# EAGLE schematic XibecaModule (EAGLE 9.6.2)
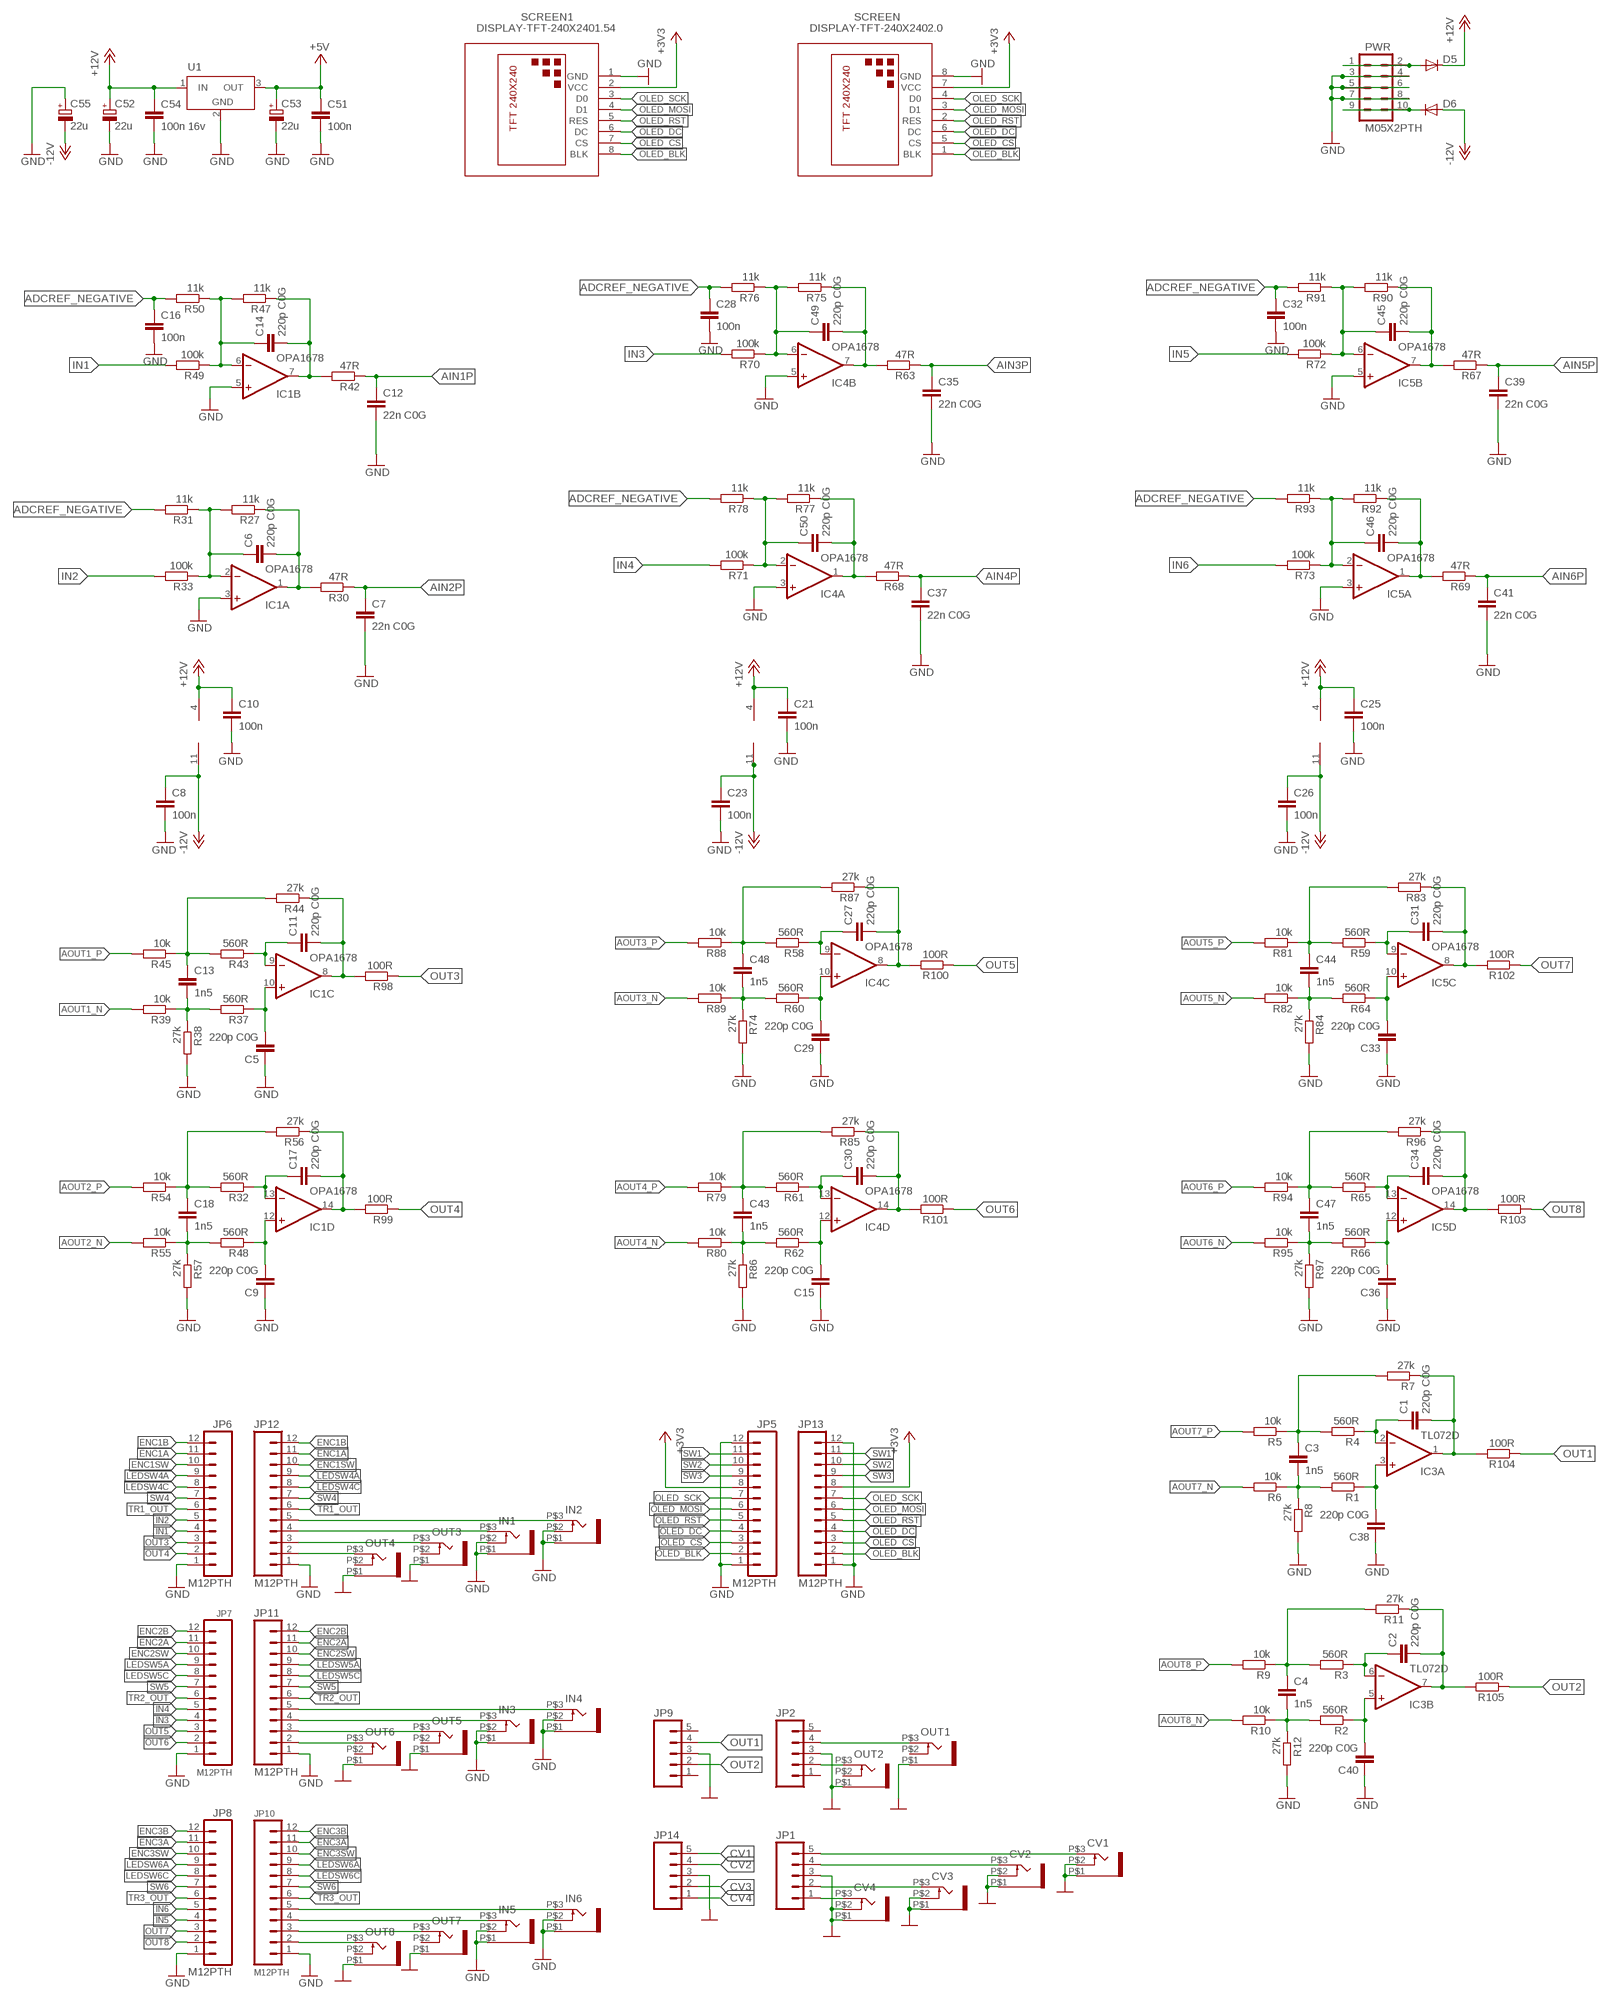
[diagram p0: schematic, sheet 1, part 1 of 2]
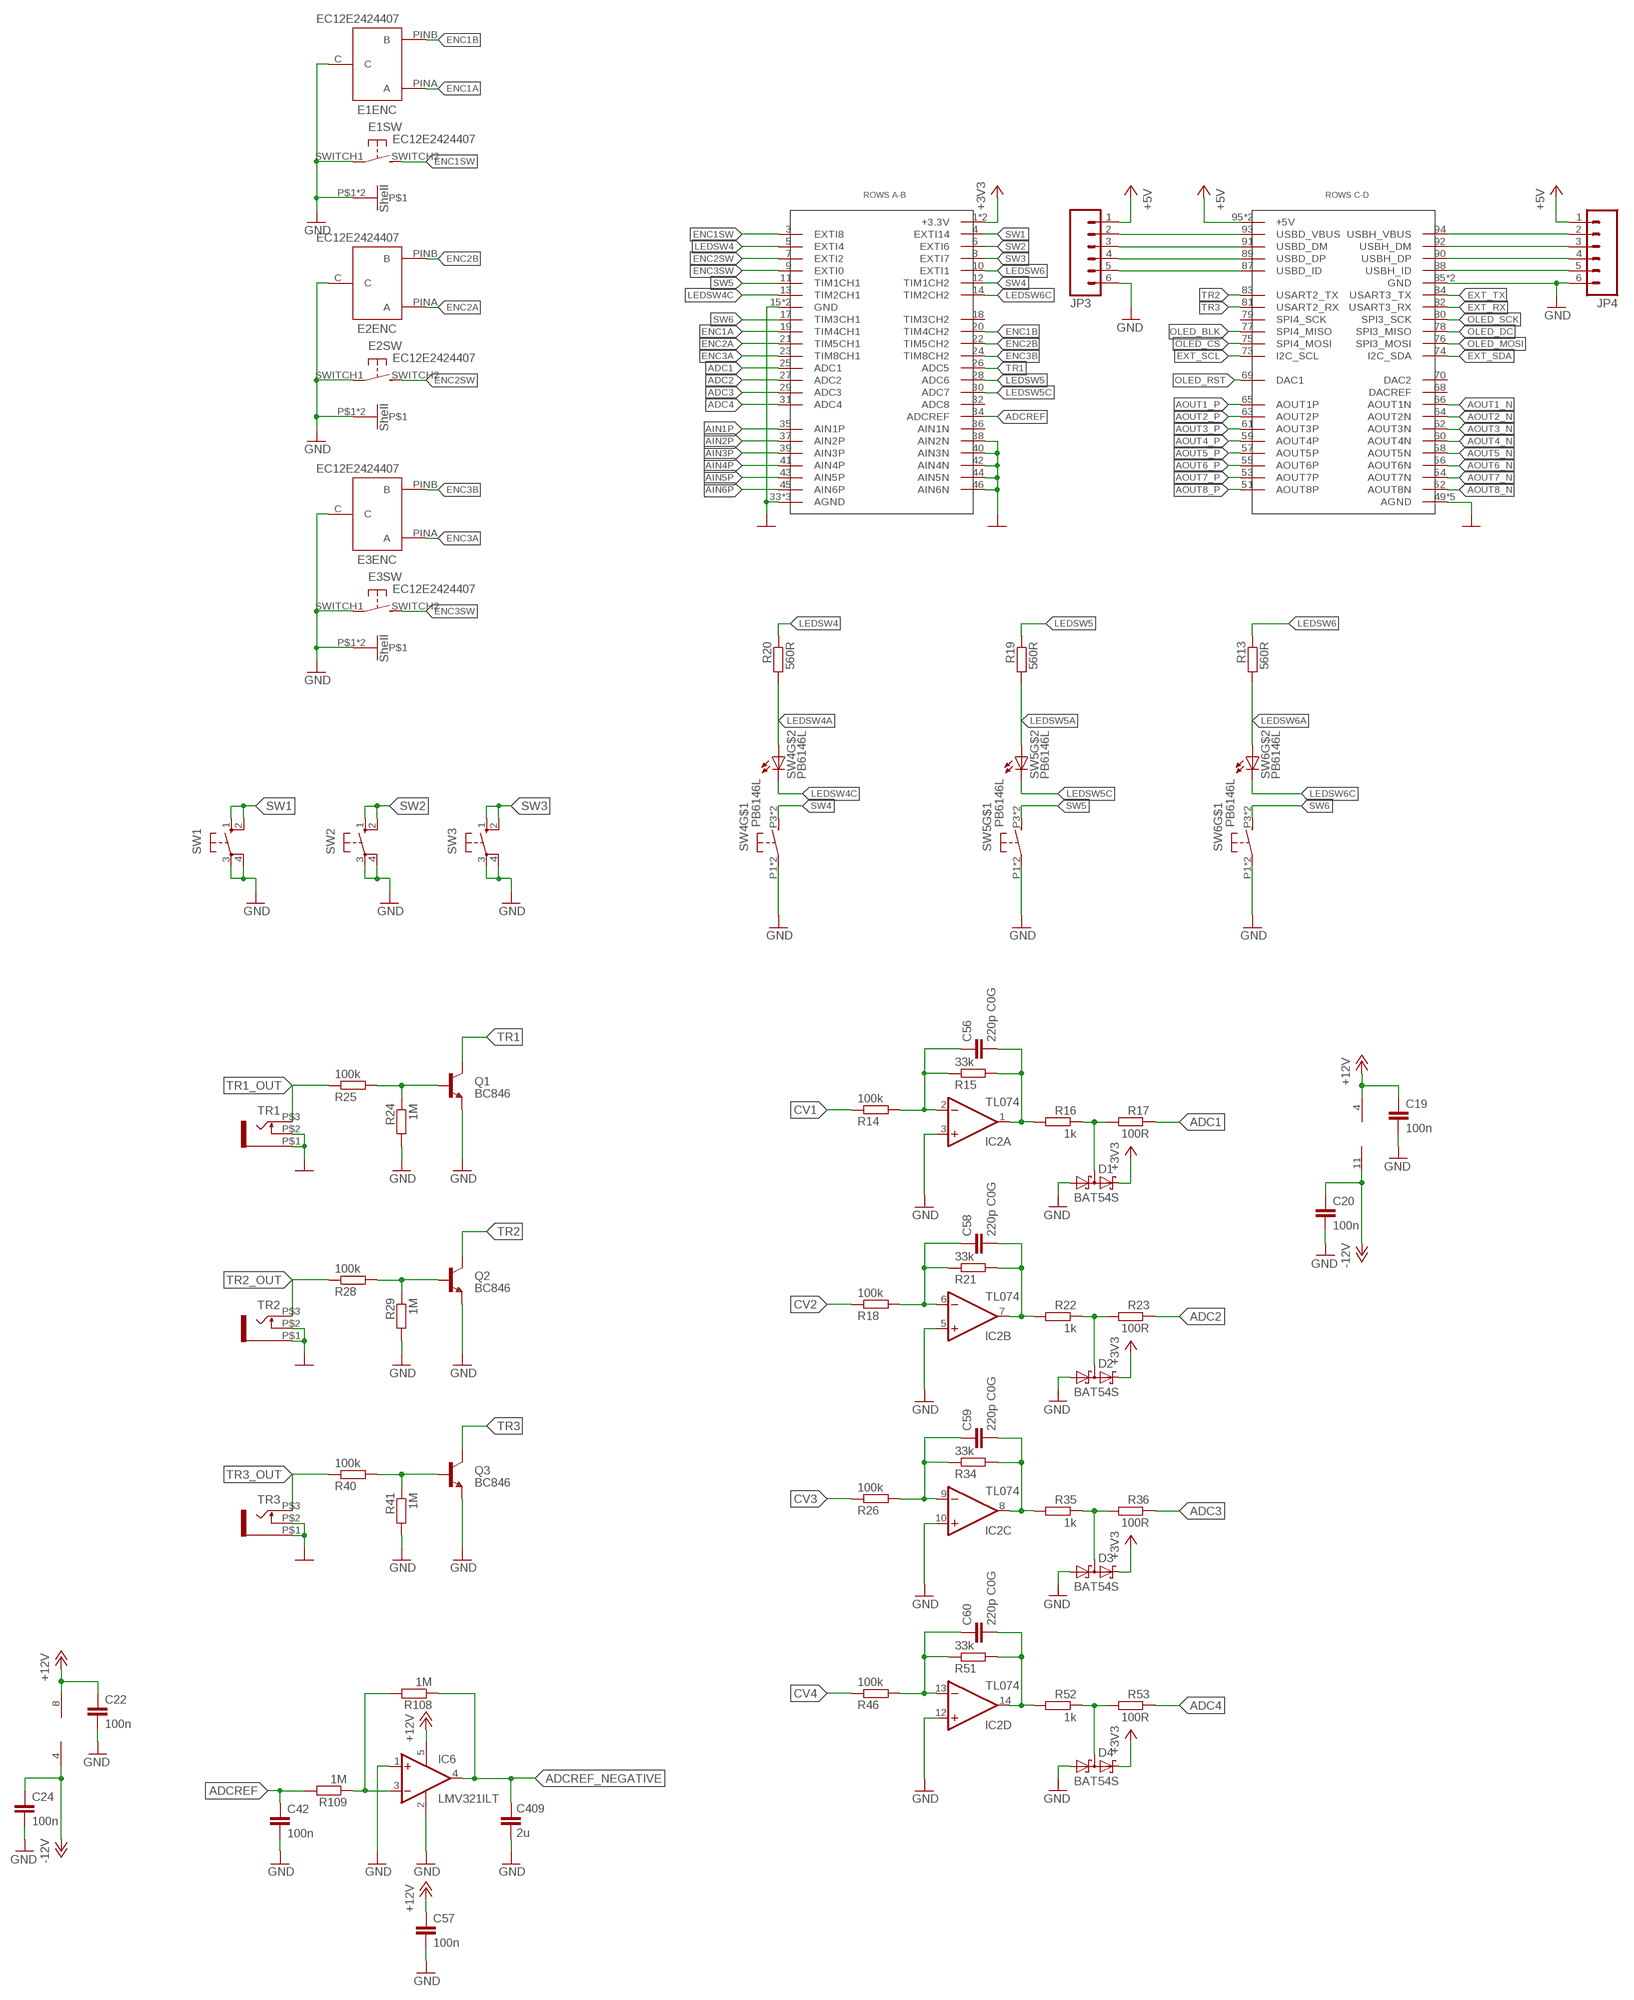
[diagram p1: schematic, sheet 1, part 2 of 2]

## Parts
C1  220p C0G  C-EUC0603  [C0603]
C2  220p C0G  C-EUC0603  [C0603]
C3  1n5  C-EUC0603  [C0603]
C4  1n5  C-EUC0603  [C0603]
C5  220p C0G  C-EUC0603  [C0603]
C6  220p C0G  C-EUC0603  [C0603]
C7  22n C0G  C-EUC0603  [C0603]
C8  100n  C-EUC0603  [C0603]
C9  220p C0G  C-EUC0603  [C0603]
C10  100n  C-EUC0603  [C0603]
C11  220p C0G  C-EUC0603  [C0603]
C12  22n C0G  C-EUC0603  [C0603]
C13  1n5  C-EUC0603  [C0603]
C14  220p C0G  C-EUC0603  [C0603]
C15  220p C0G  C-EUC0603  [C0603]
C16  100n  C-EUC0603  [C0603]
C17  220p C0G  C-EUC0603  [C0603]
C18  1n5  C-EUC0603  [C0603]
C19  100n  C-EUC0603  [C0603]
C20  100n  C-EUC0603  [C0603]
C21  100n  C-EUC0603  [C0603]
C22  100n  C-EUC0603  [C0603]
C23  100n  C-EUC0603  [C0603]
C24  100n  C-EUC0603  [C0603]
C25  100n  C-EUC0603  [C0603]
C26  100n  C-EUC0603  [C0603]
C27  220p C0G  C-EUC0603  [C0603]
C28  100n  C-EUC0603  [C0603]
C29  220p C0G  C-EUC0603  [C0603]
C30  220p C0G  C-EUC0603  [C0603]
C31  220p C0G  C-EUC0603  [C0603]
C32  100n  C-EUC0603  [C0603]
C33  220p C0G  C-EUC0603  [C0603]
C34  220p C0G  C-EUC0603  [C0603]
C35  22n C0G  C-EUC0603  [C0603]
C36  220p C0G  C-EUC0603  [C0603]
C37  22n C0G  C-EUC0603  [C0603]
C38  220p C0G  C-EUC0603  [C0603]
C39  22n C0G  C-EUC0603  [C0603]
C40  220p C0G  C-EUC0603  [C0603]
C41  22n C0G  C-EUC0603  [C0603]
C42  100n  C-EUC0603  [C0603]
C43  1n5  C-EUC0603  [C0603]
C44  1n5  C-EUC0603  [C0603]
C45  220p C0G  C-EUC0603  [C0603]
C46  220p C0G  C-EUC0603  [C0603]
C47  1n5  C-EUC0603  [C0603]
C48  1n5  C-EUC0603  [C0603]
C49  220p C0G  C-EUC0603  [C0603]
C50  220p C0G  C-EUC0603  [C0603]
C51  100n  C-EUC0603  [C0603]
C52  22u  CPOL-EUE5-8.5  [E5-8,5]
C53  22u  CPOL-EUE5-8.5  [E5-8,5]
C54  100n 16v  C-EUC0603  [C0603]
C55  22u  CPOL-EUE5-8.5  [E5-8,5]
C56  220p C0G  C-EUC0603  [C0603]
C57  100n  C-EUC0603  [C0603]
C58  220p C0G  C-EUC0603  [C0603]
C59  220p C0G  C-EUC0603  [C0603]
C60  220p C0G  C-EUC0603  [C0603]
C409  2u  C-EUC0603  [C0603]
CV1  THONKICONN  [THONKICONN]
CV2  THONKICONN  [THONKICONN]
CV3  THONKICONN  [THONKICONN]
CV4  THONKICONN  [THONKICONN]
D1  BAT54S  [SOT23]
D2  BAT54S  [SOT23]
D3  BAT54S  [SOT23]
D4  BAT54S  [SOT23]
D5  DIODE1N4001  [DIODE-1N4001]
D6  DIODE1N4001  [DIODE-1N4001]
E1  EC12E2424407  [EC12E2424407]
E2  EC12E2424407  [EC12E2424407]
E3  EC12E2424407  [EC12E2424407]
IC1  OPA1678  TL074D  [SO14]
IC2  TL074  QUAD_OPAMPD  [SO14]
IC3  TL072D  [SO08]
IC4  OPA1678  TL074D  [SO14]
IC5  OPA1678  TL074D  [SO14]
IC6  LMV321ILT  LM321MF  [SOT23-5]
IN1  THONKICONN  [THONKICONN]
IN2  THONKICONN  [THONKICONN]
IN3  THONKICONN  [THONKICONN]
IN4  THONKICONN  [THONKICONN]
IN5  THONKICONN  [THONKICONN]
IN6  THONKICONN  [THONKICONN]
JP1  M05PTH  [1X05]
JP2  M05PTH  [1X05]
JP3  M06SIP  [1X06]
JP4  M06SIP  [1X06]
JP5  M12PTH  [1X12]
JP6  M12PTH  [1X12]
JP7  M12PTH  [1X12]
JP8  M12PTH  [1X12]
JP9  M05PTH  [1X05]
JP10  M12PTH  [1X12]
JP11  M12PTH  [1X12]
JP12  M12PTH  [1X12]
JP13  M12PTH  [1X12]
JP14  M05PTH  [1X05]
OUT1  THONKICONN  [THONKICONN]
OUT2  THONKICONN  [THONKICONN]
OUT3  THONKICONN  [THONKICONN]
OUT4  THONKICONN  [THONKICONN]
OUT5  THONKICONN  [THONKICONN]
OUT6  THONKICONN  [THONKICONN]
OUT7  THONKICONN  [THONKICONN]
OUT8  THONKICONN  [THONKICONN]
PWR  M05X2PTH  [AVR_ICSP]
Q1  BC846  [SOT23]
Q2  BC846  [SOT23]
Q3  BC846  [SOT23]
R1  560R  R-EU_R0603  [R0603]
R2  560R  R-EU_R0603  [R0603]
R3  560R  R-EU_R0603  [R0603]
R4  560R  R-EU_R0603  [R0603]
R5  10k  R-EU_R0603  [R0603]
R6  10k  R-EU_R0603  [R0603]
R7  27k  R-EU_R0603  [R0603]
R8  27k  R-EU_R0603  [R0603]
R9  10k  R-EU_R0603  [R0603]
R10  10k  R-EU_R0603  [R0603]
R11  27k  R-EU_R0603  [R0603]
R12  27k  R-EU_R0603  [R0603]
R13  560R  R-EU_R0603  [0603]
R14  100k  R-EU_0603  [0603]
R15  33k  R-EU_0603  [0603]
R16  1k  R-EU_0603  [0603]
R17  100R  R-EU_0603  [0603]
R18  100k  R-EU_0603  [0603]
R19  560R  R-EU_R0603  [0603]
R20  560R  R-EU_R0603  [0603]
R21  33k  R-EU_0603  [0603]
R22  1k  R-EU_0603  [0603]
R23  100R  R-EU_0603  [0603]
R24  1M  R-EU_R0603  [0603]
R25  100k  R-EU_R0603  [0603]
R26  100k  R-EU_0603  [0603]
R27  11k  R-EU_R0603  [R0603]
R28  100k  R-EU_R0603  [0603]
R29  1M  R-EU_R0603  [0603]
R30  47R  R-EU_R0603  [R0603]
R31  11k  R-EU_R0603  [R0603]
R32  560R  R-EU_R0603  [R0603]
R33  100k  R-EU_R0603  [R0603]
R34  33k  R-EU_0603  [0603]
R35  1k  R-EU_0603  [0603]
R36  100R  R-EU_0603  [0603]
R37  560R  R-EU_R0603  [R0603]
R38  27k  R-EU_R0603  [R0603]
R39  10k  R-EU_R0603  [R0603]
R40  100k  R-EU_R0603  [0603]
R41  1M  R-EU_R0603  [0603]
R42  47R  R-EU_R0603  [R0603]
R43  560R  R-EU_R0603  [R0603]
R44  27k  R-EU_R0603  [R0603]
R45  10k  R-EU_R0603  [R0603]
R46  100k  R-EU_0603  [0603]
R47  11k  R-EU_R0603  [R0603]
R48  560R  R-EU_R0603  [R0603]
R49  100k  R-EU_R0603  [R0603]
R50  11k  R-EU_R0603  [R0603]
R51  33k  R-EU_0603  [0603]
R52  1k  R-EU_0603  [0603]
R53  100R  R-EU_0603  [0603]
R54  10k  R-EU_R0603  [R0603]
R55  10k  R-EU_R0603  [R0603]
R56  27k  R-EU_R0603  [R0603]
R57  27k  R-EU_R0603  [R0603]
R58  560R  R-EU_R0603  [R0603]
R59  560R  R-EU_R0603  [R0603]
R60  560R  R-EU_R0603  [R0603]
R61  560R  R-EU_R0603  [R0603]
R62  560R  R-EU_R0603  [R0603]
R63  47R  R-EU_R0603  [R0603]
R64  560R  R-EU_R0603  [R0603]
R65  560R  R-EU_R0603  [R0603]
R66  560R  R-EU_R0603  [R0603]
R67  47R  R-EU_R0603  [R0603]
R68  47R  R-EU_R0603  [R0603]
R69  47R  R-EU_R0603  [R0603]
R70  100k  R-EU_R0603  [R0603]
R71  100k  R-EU_R0603  [R0603]
R72  100k  R-EU_R0603  [R0603]
R73  100k  R-EU_R0603  [R0603]
R74  27k  R-EU_R0603  [R0603]
R75  11k  R-EU_R0603  [R0603]
R76  11k  R-EU_R0603  [R0603]
R77  11k  R-EU_R0603  [R0603]
R78  11k  R-EU_R0603  [R0603]
R79  10k  R-EU_R0603  [R0603]
R80  10k  R-EU_R0603  [R0603]
R81  10k  R-EU_R0603  [R0603]
R82  10k  R-EU_R0603  [R0603]
R83  27k  R-EU_R0603  [R0603]
R84  27k  R-EU_R0603  [R0603]
R85  27k  R-EU_R0603  [R0603]
R86  27k  R-EU_R0603  [R0603]
R87  27k  R-EU_R0603  [R0603]
R88  10k  R-EU_R0603  [R0603]
R89  10k  R-EU_R0603  [R0603]
R90  11k  R-EU_R0603  [R0603]
R91  11k  R-EU_R0603  [R0603]
R92  11k  R-EU_R0603  [R0603]
R93  11k  R-EU_R0603  [R0603]
R94  10k  R-EU_R0603  [R0603]
R95  10k  R-EU_R0603  [R0603]
R96  27k  R-EU_R0603  [R0603]
R97  27k  R-EU_R0603  [R0603]
R98  100R  R-EU_R0603  [R0603]
R99  100R  R-EU_R0603  [R0603]
R100  100R  R-EU_R0603  [R0603]
R101  100R  R-EU_R0603  [R0603]
R102  100R  R-EU_R0603  [R0603]
R103  100R  R-EU_R0603  [R0603]
R104  100R  R-EU_R0603  [R0603]
R105  100R  R-EU_R0603  [R0603]
R108  1M  R-EU_R0603  [R0603]
R109  1M  R-EU_R0603  [R0603]
SCREEN  DISPLAY-TFT-240X2402.0  [DISPLAY-TFT-240X320-2.0"]
SCREEN1  DISPLAY-TFT-240X2401.54  [DISPLAY-TFT-240X240-1.54"]
SW1  10-XX  [B3F-10XX]
SW2  10-XX  [B3F-10XX]
SW3  10-XX  [B3F-10XX]
SW4  PB6146L  [PB6146L]
SW5  PB6146L  [PB6146L]
SW6  PB6146L  [PB6146L]
TR1  THONKICONN  [THONKICONN]
TR2  THONKICONN  [THONKICONN]
TR3  THONKICONN  [THONKICONN]
U1  TSR-1-2450  [TSR-1-2450]
U$2  NOCTUA2NOCTUA2  [NOCTUA]

## Nets
+3V3: D1.2(C2) D2.2(C2) D3.2(C2) D4.2(C2) JP5.8 JP13.8 SCREEN1.2(VCC) SCREEN.7(VCC) U$2.1(+3.3V) U$2.2(+3.3V)
+5V: C51.1 C53.+ JP3.1 JP4.1 U1.3(OUT) U$2.95(+5V) U$2.96(+5V)
+12V: C10.1 C19.1 C21.1 C22.1 C25.1 C52.+ C54.1 C57.1 D5.C IC1.4(P:V+) IC2.4(P:V+) IC3.8(P:V+) IC4.4(P:V+) IC5.4(P:V+) IC6.5(V+) U1.1(IN)
-12V: C8.1 C20.1 C23.1 C24.1 C26.1 C55.- D6.A IC1.11(P:V-) IC2.11(P:V-) IC3.4(P:V-) IC4.11(P:V-) IC5.11(P:V-)
ADC1: R17.1 U$2.25(ADC1)
ADC2: R23.1 U$2.27(ADC2)
ADC3: R36.1 U$2.29(ADC3)
ADC4: R53.1 U$2.31(ADC4)
ADCREF: C42.1 R109.2 U$2.34(ADCREF)
ADCREF_NEGATIVE: C16.1 C28.1 C32.1 C409.1 IC6.4(OUT) R31.2 R50.2 R76.2 R78.2 R91.2 R93.2 R108.1
AIN1P: C12.1 R42.1 U$2.35(AIN1P)
AIN2P: C7.1 R30.1 U$2.37(AIN2P)
AIN3P: C35.1 R63.1 U$2.39(AIN3P)
AIN4P: C37.1 R68.1 U$2.41(AIN4P)
AIN5P: C39.1 R67.1 U$2.43(AIN5P)
AIN6P: C41.1 R69.1 U$2.45(AIN6P)
AOUT1_N: R39.2 U$2.66(AOUT1N)
AOUT1_P: R45.2 U$2.65(AOUT1P)
AOUT2_N: R55.2 U$2.64(AOUT2N)
AOUT2_P: R54.2 U$2.63(AOUT2P)
AOUT3_N: R89.2 U$2.62(AOUT3N)
AOUT3_P: R88.2 U$2.61(AOUT3P)
AOUT4_N: R80.2 U$2.60(AOUT4N)
AOUT4_P: R79.2 U$2.59(AOUT4P)
AOUT5_N: R82.2 U$2.58(AOUT5N)
AOUT5_P: R81.2 U$2.57(AOUT5P)
AOUT6_N: R95.2 U$2.56(AOUT6N)
AOUT6_P: R94.2 U$2.55(AOUT6P)
AOUT7_N: R6.2 U$2.54(AOUT7N)
AOUT7_P: R5.2 U$2.53(AOUT7P)
AOUT8_N: R10.2 U$2.52(AOUT8N)
AOUT8_P: R9.2 U$2.51(AOUT8P)
CV1: JP14.5 R14.1
CV2: JP14.4 R18.1
CV3: JP14.2 R26.1
CV4: JP14.1 R46.1
ENC1A: E1.PINA(ENC:A) JP6.11 JP12.11 U$2.19(TIM4CH1)
ENC1B: E1.PINB(ENC:B) JP6.12 JP12.12 U$2.20(TIM4CH2)
ENC1SW: E1.SWITCH2(SW:S) JP6.10 JP12.10 U$2.3(EXTI8)
ENC2A: E2.PINA(ENC:A) JP7.11 JP11.11 U$2.21(TIM5CH1)
ENC2B: E2.PINB(ENC:B) JP7.12 JP11.12 U$2.22(TIM5CH2)
ENC2SW: E2.SWITCH2(SW:S) JP7.10 JP11.10 U$2.7(EXTI2)
ENC3A: E3.PINA(ENC:A) JP8.11 JP10.11 U$2.23(TIM8CH1)
ENC3B: E3.PINB(ENC:B) JP8.12 JP10.12 U$2.24(TIM8CH2)
ENC3SW: E3.SWITCH2(SW:S) JP8.10 JP10.10 U$2.9(EXTI0)
EXT_RX: U$2.82(USART3_RX)
EXT_SCL: U$2.73(I2C_SCL)
EXT_SDA: U$2.74(I2C_SDA)
EXT_TX: U$2.84(USART3_TX)
GND: C5.1 C7.2 C8.2 C9.1 C10.2 C12.2 C15.1 C16.2 C19.2 C20.2 C21.2 C22.2 C23.2 C24.2 C25.2 C26.2 C28.2 C29.1 C32.2 C33.1 C35.2 C36.1 C37.2 C38.1 C39.2 C40.1 C41.2 C42.2 C51.2 C52.- C53.- C54.2 C55.+ C57.2 C409.2 CV1.P$1 CV1.P$2 CV2.P$1 CV2.P$2 CV3.P$1 CV3.P$2 CV4.P$1 CV4.P$2 D1.1(A1) D2.1(A1) D3.1(A1) D4.1(A1) E1.C(ENC:C) E1.P$1 E1.P$2 E1.SWITCH1(SW:P) E2.C(ENC:C) E2.P$1 E2.P$2 E2.SWITCH1(SW:P) E3.C(ENC:C) E3.P$1 E3.P$2 E3.SWITCH1(SW:P) IC1.3(A:+IN) IC1.5(B:+IN) IC2.3(A:+IN) IC2.5(B:+IN) IC2.10(C:+IN) IC2.12(D:+IN) IC4.3(A:+IN) IC4.5(B:+IN) IC5.3(A:+IN) IC5.5(B:+IN) IC6.1(+IN) IC6.2(V-) IN1.P$1 IN1.P$2 IN2.P$1 IN2.P$2 IN3.P$1 IN3.P$2 IN4.P$1 IN4.P$2 IN5.P$1 IN5.P$2 IN6.P$1 IN6.P$2 JP1.3 JP2.3 JP3.6 JP4.6 JP5.1 JP5.12 JP6.1 JP7.1 JP8.1 JP9.3 JP10.1 JP11.1 JP12.1 JP13.1 JP13.12 JP14.3 OUT1.P$1 OUT2.P$1 OUT3.P$1 OUT4.P$1 OUT5.P$1 OUT6.P$1 OUT7.P$1 OUT8.P$1 PWR.3 PWR.4 PWR.5 PWR.6 PWR.7 PWR.8 Q1.2(E) Q2.2(E) Q3.2(E) R8.2 R12.2 R24.2 R29.2 R38.2 R41.2 R57.2 R74.2 R84.2 R86.2 R97.2 SCREEN1.1(GND) SCREEN.8(GND) SW1.3(P) SW1.4(P1) SW2.3(P) SW2.4(P1) SW3.3(P) SW3.4(P1) SW4.P1(P) SW4.P2(P) SW5.P1(P) SW5.P2(P) SW6.P1(P) SW6.P2(P) TR1.P$1 TR1.P$2 TR2.P$1 TR2.P$2 TR3.P$1 TR3.P$2 U1.2(GND) U$2.15(GND) U$2.16(GND) U$2.33(AGND) U$2.38(AIN2N) U$2.40(AIN3N) U$2.42(AIN4N) U$2.44(AIN5N) U$2.46(AIN6N) U$2.47(AGND) U$2.48(AGND) U$2.49(AGND) U$2.50(AGND) U$2.67(AGND) U$2.71(AGND) U$2.72(AGND) U$2.85(GND) U$2.86(GND)
IN1: JP6.4 R49.2
IN2: JP6.5 R33.2
IN3: JP7.4 R70.2
IN4: JP7.5 R71.2
IN5: JP8.4 R72.2
IN6: JP8.5 R73.2
LEDSW4: R20.1 U$2.5(EXTI4)
LEDSW4A: JP6.9 JP12.9 R20.2 SW4.PL1(A)
LEDSW4C: JP6.8 JP12.8 SW4.PL2(C) U$2.13(TIM2CH1)
LEDSW5: R19.1 U$2.28(ADC6)
LEDSW5A: JP7.9 JP11.9 R19.2 SW5.PL1(A)
LEDSW5C: JP7.8 JP11.8 SW5.PL2(C) U$2.30(ADC7)
LEDSW6: R13.1 U$2.10(EXTI1)
LEDSW6A: JP8.9 JP10.9 R13.2 SW6.PL1(A)
LEDSW6C: JP8.8 JP10.8 SW6.PL2(C) U$2.14(TIM2CH2)
N$1: C17.2 IC1.14(D:OUT) R56.1 R99.2
N$2: C18.2 R48.2 R55.1 R57.1
N$3: C18.1 R32.2 R54.1 R56.2
N$4: C6.2 IC1.1(A:OUT) R27.1 R30.2
N$5: C17.1 IC1.13(D:-IN) R32.1
N$6: C6.1 IC1.2(A:-IN) R27.2 R31.1 R33.1
N$7: D6.C PWR.9 PWR.10
N$8: C9.2 IC1.12(D:+IN) R48.1
N$9: D5.A PWR.1 PWR.2
N$10: C34.2 IC5.14(D:OUT) R96.1 R103.2
N$11: C48.2 R60.2 R74.1 R89.1
N$12: C48.1 R58.2 R87.2 R88.1
N$13: C27.1 IC4.9(C:-IN) R58.1
N$14: C29.2 IC4.10(C:+IN) R60.1
N$15: C27.2 IC4.8(C:OUT) R87.1 R100.2
N$16: C30.2 IC4.14(D:OUT) R85.1 R101.2
N$17: C49.2 IC4.7(B:OUT) R63.2 R75.1
N$18: C49.1 IC4.6(B:-IN) R70.1 R75.2 R76.1
N$19: IN2.P$3 JP12.5
N$20: C50.2 IC4.1(A:OUT) R68.2 R77.1
N$21: C50.1 IC4.2(A:-IN) R71.1 R77.2 R78.1
N$22: C31.2 IC5.8(C:OUT) R83.1 R102.2
N$23: C43.2 R62.2 R80.1 R86.1
N$24: C43.1 R61.2 R79.1 R85.2
N$25: C30.1 IC4.13(D:-IN) R61.1
N$26: C15.2 IC4.12(D:+IN) R62.1
N$27: IC6.3(-IN) R108.2 R109.1
N$28: C1.2 IC3.1(A:OUT) R7.1 R104.2
N$29: C3.2 R1.2 R6.1 R8.1
N$30: Q1.1(B) R24.1 R25.2
N$31: C3.1 R4.2 R5.1 R7.2
N$32: C2.2 IC3.7(B:OUT) R11.1 R105.2
N$33: IN1.P$3 JP12.4
N$34: JP12.3 OUT3.P$3
N$35: C44.2 R64.2 R82.1 R84.1
N$36: C44.1 R59.2 R81.1 R83.2
N$37: C31.1 IC5.9(C:-IN) R59.1
N$38: C33.2 IC5.10(C:+IN) R64.1
N$39: C11.2 IC1.8(C:OUT) R44.1 R98.2
N$40: Q2.1(B) R28.2 R29.1
N$41: C45.2 IC5.7(B:OUT) R67.2 R90.1
N$42: C45.1 IC5.6(B:-IN) R72.1 R90.2 R91.1
N$43: JP12.2 OUT4.P$3
N$44: C46.2 IC5.1(A:OUT) R69.2 R92.1
N$45: C46.1 IC5.2(A:-IN) R73.1 R92.2 R93.1
N$46: JP11.2 OUT6.P$3
N$47: C47.2 R66.2 R95.1 R97.1
N$48: C47.1 R65.2 R94.1 R96.2
N$49: C34.1 IC5.13(D:-IN) R65.1
N$50: C36.2 IC5.12(D:+IN) R66.1
N$51: JP11.3 OUT5.P$3
N$52: C58.1 IC2.6(B:-IN) R18.2 R21.1
N$54: JP2.4 OUT1.P$3
N$55: JP2.2 OUT2.P$3
N$57: C56.1 IC2.2(A:-IN) R14.2 R15.1
N$58: IN3.P$3 JP11.4
N$59: Q3.1(B) R40.2 R41.1
N$60: C1.1 IC3.2(A:-IN) R4.1
N$61: C38.2 IC3.3(A:+IN) R1.1
N$62: IN4.P$3 JP11.5
N$63: C4.2 R2.2 R10.1 R12.1
N$64: C4.1 R3.2 R9.1 R11.2
N$65: C2.1 IC3.6(B:-IN) R3.1
N$66: C40.2 IC3.5(B:+IN) R2.1
N$67: JP10.2 OUT8.P$3
N$68: C56.2 IC2.1(A:OUT) R15.2 R16.2
N$69: D1.3(C1A2) R16.1 R17.2
N$70: C58.2 IC2.7(B:OUT) R21.2 R22.2
N$71: D2.3(C1A2) R22.1 R23.2
N$72: C59.1 IC2.9(C:-IN) R26.2 R34.1
N$73: C59.2 IC2.8(C:OUT) R34.2 R35.2
N$74: D3.3(C1A2) R35.1 R36.2
N$75: C60.1 IC2.13(D:-IN) R46.2 R51.1
N$76: C60.2 IC2.14(D:OUT) R51.2 R52.2
N$77: D4.3(C1A2) R52.1 R53.2
N$78: JP3.2 U$2.93(USBD_VBUS)
N$79: JP3.3 U$2.91(USBD_DM)
N$80: JP3.4 U$2.89(USBD_DP)
N$81: JP3.5 U$2.87(USBD_ID)
N$82: JP4.5 U$2.88(USBH_ID)
N$83: JP4.4 U$2.90(USBH_DP)
N$84: JP4.3 U$2.92(USBH_DM)
N$85: JP4.2 U$2.94(USBH_VBUS)
N$86: JP10.3 OUT7.P$3
N$87: IN5.P$3 JP10.4
N$88: IN6.P$3 JP10.5
N$89: CV4.P$3 JP1.1
N$90: CV1.P$3 JP1.5
N$91: CV2.P$3 JP1.4
N$92: CV3.P$3 JP1.2
N$214: C13.2 R37.2 R38.1 R39.1
N$215: C13.1 R43.2 R44.2 R45.1
N$216: C11.1 IC1.9(C:-IN) R43.1
N$217: C5.2 IC1.10(C:+IN) R37.1
N$220: C14.2 IC1.7(B:OUT) R42.2 R47.1
N$223: C14.1 IC1.6(B:-IN) R47.2 R49.1 R50.1
OLED_BLK: JP5.2 JP13.2 SCREEN1.8(BLK) SCREEN.1(BLK) U$2.77(SPI4_MISO)
OLED_CS: JP5.3 JP13.3 SCREEN1.7(CS) SCREEN.5(CS) U$2.75(SPI4_MOSI)
OLED_DC: JP5.4 JP13.4 SCREEN1.6(DC) SCREEN.6(DC) U$2.78(SPI3_MISO)
OLED_MOSI: JP5.6 JP13.6 SCREEN1.4(D1) SCREEN.3(D1) U$2.76(SPI3_MOSI)
OLED_RST: JP5.5 JP13.5 SCREEN1.5(RES) SCREEN.2(RES) U$2.69(DAC1)
OLED_SCK: JP5.7 JP13.7 SCREEN1.3(D0) SCREEN.4(D0) U$2.80(SPI3_SCK)
OUT1: JP9.4 R104.1
OUT2: JP9.2 R105.1
OUT3: JP6.3 R98.1
OUT4: JP6.2 R99.1
OUT5: JP7.3 R100.1
OUT6: JP7.2 R101.1
OUT7: JP8.3 R102.1
OUT8: JP8.2 R103.1
SW1: JP5.11 JP13.11 SW1.1(S) SW1.2(S1) U$2.4(EXTI14)
SW2: JP5.10 JP13.10 SW2.1(S) SW2.2(S1) U$2.6(EXTI6)
SW3: JP5.9 JP13.9 SW3.1(S) SW3.2(S1) U$2.8(EXTI7)
SW4: JP6.7 JP12.7 SW4.P3(S) SW4.P4(S) U$2.12(TIM1CH2)
SW5: JP7.7 JP11.7 SW5.P3(S) SW5.P4(S) U$2.11(TIM1CH1)
SW6: JP8.7 JP10.7 SW6.P3(S) SW6.P4(S) U$2.17(TIM3CH1)
TR1: Q1.3(C) U$2.26(ADC5)
TR1_OUT: JP6.6 JP12.6 R25.1 TR1.P$3
TR2: Q2.3(C) U$2.83(USART2_TX)
TR2_OUT: JP7.6 JP11.6 R28.1 TR2.P$3
TR3: Q3.3(C) U$2.81(USART2_RX)
TR3_OUT: JP8.6 JP10.6 R40.1 TR3.P$3
Unconnected: JP2.1 JP2.5 JP9.1 JP9.5 OUT1.P$2 OUT2.P$2 OUT3.P$2 OUT4.P$2 OUT5.P$2 OUT6.P$2 OUT7.P$2 OUT8.P$2 U$2.18(TIM3CH2) U$2.32(ADC8) U$2.36(AIN1N) U$2.68(DACREF) U$2.70(DAC2) U$2.79(SPI4_SCK)

## Library data of the parts
C1-C51 C54 C56-C60 C409 = Rebel:C-EU: CAPACITOR, European symbol
C52 C53 C55 = Rebel:CPOL-EU: POLARIZED CAPACITOR, European symbol
CV1-CV4 IN1-IN6 OUT1-OUT8 TR1-TR3 = Rebel:THONKICONN
D1-D4 = diode:BAT54S: Schottky Diodes Pin connection corrected 2011-05-04 Source: Fairchild .. BAT54.pdf
D5 D6 = Rebel:DIODE: Diode These are standard reverse protection diodes and small signal diodes. SMA package can handle up to about 1A. SOD-323 can handle about 200mA. Watch the SOD-323 package when ordering, there are some mfgs out there that are 5-pin packages.
E1-E3 = Rebel:EC12E2424407: rotary encoder with switch EC12E2424407
IC1 IC4 IC5 = Rebel:TL074: OP AMP
IC2 = adafruit:QUAD_OPAMP: OP AMP Standard quad package
IC3 = linear:TL072: OP AMP
IC6 = linear:LM321?*: Low Power Single Op Amp Source: http://cache.national.com/ds/LM/LM321.pdf
JP1 JP2 JP9 JP14 = SparkFun:M05: Header 5 Standard 5-pin 0.1" header. Use with straight break away headers (SKU : PRT-00116), right angle break away headers (PRT-00553), swiss pins (PRT-00743), machine pins (PRT-00117), and female headers (PRT-00115). Molex polarized connector foot print use with SKU : PRT-08230 with associated crimp pins and housings.
JP3 JP4 = SparkFun:M06: Header 6 Standard 6-pin 0.1" header. Use with straight break away headers (SKU : PRT-00116), right angle break away headers (PRT-00553), swiss pins (PRT-00743), machine pins (PRT-00117), and female headers (PRT-00115). Molex polarized connector foot print use with SKU : PRT-08094 with associated crimp pins and housings. NOTES ON THE VARIANTS LOCK and LOCK_LONGPADS... This footprint was designed to help hold the alignment of a through-hole component (i.e. 6-pin header) while soldering it into place. You may notice that each hole has been shifted either up or down by 0.005 of an inch from it's more standard position (which is a perfectly straight line). This slight alteration caused the pins (the squares in the middle) to touch the edges of the holes. Because they are alternating, it causes a "brace" to hold the component in place. 0.005 has proven to be the perfect amount of "off-center" position when using our standard breakaway headers. Although looks a little odd when you look at the bare footprint, once you have a header in there, the alteration is very hard to notice. Also, if you push a header all the way into place, it is covered up entirely on the bottom side. This idea of altering the position of holes to aid alignment will be further integrated into the Sparkfun Library for other footprints. It can help hold any component with 3 or more connection pins.
JP5-JP8 JP10-JP13 = SparkFun:M12: Header 12 Standard 12-pin 0.1" header. Use with straight break away headers (SKU : PRT-00116), right angle break away headers (PRT-00553), swiss pins (PRT-00743), machine pins (PRT-00117), and female headers (PRT-00115).
PWR = SparkFun:M05X2: Header 5x2 Standard 10-pin dual row 0.1" header. Commonly used with AVR-ISP. Use with Spark Fun Electronics SKU: PRT-00778
Q1-Q3 = transistor:BC846: NPN TRANSISTOR
R1-R12 R27 R30-R33 R37-R39 R42-R45 R47-R50 R54-R105 R108 R109 = rcl:R-EU_: RESISTOR, European symbol; SPICEPREFIX: R
R13-R26 R28 R29 R34-R36 R40 R41 R46 R51-R53 = Rebel:R-EU_: RESISTOR, European symbol
SCREEN SCREEN1 = diy-modules:DISPLAY-TFT-240X240: 240X240 TFT Screen Module with ST7789 driver chip Variant with SPI interface
SW1-SW3 = switch-omron:10-XX: OMRON SWITCH; MPN: B3F-1000; OC_FARNELL: 176432; OC_NEWARK: 36M3542
SW4-SW6 = Rebel:PB6146L
U1 = Hangar:TSR-1-2450
U$2 = Rebel platforms:NOCTUA2

## Net classes
1 power: width 0.178 mm, drill 0.305 mm, clearance 0.178 mm to class 0, clearance 0.178 mm